# Altium schematic sheet Robonaut2.SchDoc
size A4
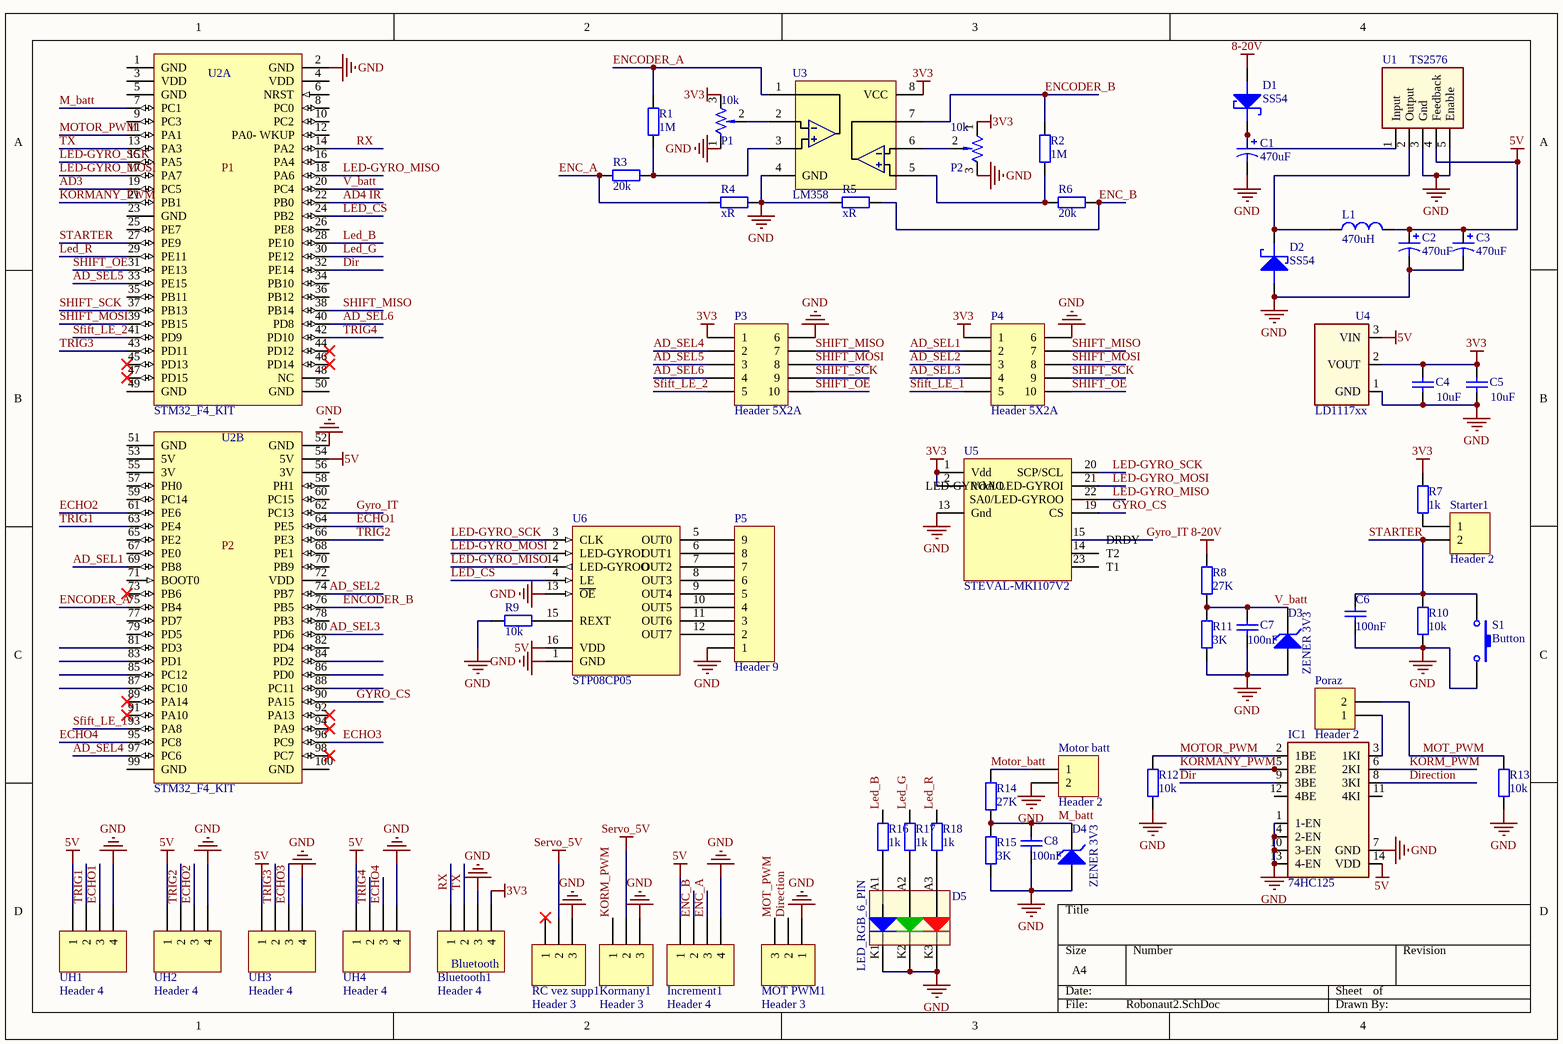
[diagram p0: Robonaut2.SchDoc]

## Parts
Bluetooth1  Header 4  [HDR1X4]
C1  470uF  [cap_10x12]
C2  470uF  [cap_10x12]
C3  470uF  [cap_10x12]
C4  10uF  [FP_0603_CAP_080]
C5  10uF  [FP_0603_CAP_080]
C6  100nF  [FP_0805_CAP_085]
C7  100nF  [FP_0805_CAP_085]
C8  100nF  [FP_0805_CAP_085]
D1  SS54  [FP_SMA DO214AB]
D2  SS54  [FP_SMA DO214AB]
D3  ZENER 3V3  [sod-80]
D4  ZENER 3V3  [sod-80]
D5  LED_RGB_6_PIN  [LED_PLCC-6]
IC1  74HC125  [Gate_SOIC14]
Increment1  Header 4  [HDR1X4]
Kormany1  Header 3  [HDR1X3]
L1  470uH  [SRR1206_T]
MOT_PWM1  Header 3  [HDR1X3]
Motor_batt  Header 2  [HDR1X2]
P1  10k  [Res Trimmer TH]
P2  10k  [Res Trimmer TH]
P3  Header 5X2A  [HDR2X5_CEN]
P4  Header 5X2A  [HDR2X5_CEN]
P5  Header 9  [HDR1X9]
Poraz  Header 2  [HDR1X2]
R1  1M  [FP_0805_RES]
R2  1M  [FP_0805_RES]
R3  20k  [FP_0805_RES]
R4  xR  [FP_0805_RES]
R5  xR  [FP_0805_RES]
R6  20k  [FP_0805_RES]
R7  1k  [FP_0805_RES]
R8  27K  [FP_0805_RES]
R9  10k  [FP_0805_RES]
R10  10k  [FP_0805_RES]
R11  3K  [FP_0805_RES]
R12  10k  [FP_0805_RES]
R13  10k  [FP_0805_RES]
R14  27K  [FP_0805_RES]
R15  3K  [FP_0805_RES]
R16  1k  [FP_0805_RES]
R17  1k  [FP_0805_RES]
R18  1k  [FP_0805_RES]
RC_vez_supp1  Header 3  [HDR1X3]
S1  Button  [BUTTON_6X6 _SMD]
Starter1  Header 2  [HDR1X2]
U1  TS2576  [SUPPLY_TO-263 5]
U2  STM32_F4_KIT  [FP_STM32F4DISC]  (parts A,B of 2)
U3  LM358  [FP_SO8_MS012AA]
U4  LD1117xx  [SUPPLY_SOT223]
U5  STEVAL-MKI107V2  [STEVAL-MKI107V2 DIL24 Adapter]
U6  STP08CP05  [TSSOP16]
UH1  Header 4  [HDR1X4]
UH2  Header 4  [HDR1X4]
UH3  Header 4  [HDR1X4]
UH4  Header 4  [HDR1X4]

## Nets
3V3: Bluetooth1.4 C4.2 C5.2 P1.3 P2.1 P3.1 P4.1 R7.2 U3.8(VCC) U4.2(VOUT) U5.1(Vdd) U5.2(VddIO)
5V: C2.P C3.P IC1.14(VDD) Increment1.1 L1.2 U1.4(Feedback) U2.54(5V) U4.3(VIN) U6.16(VDD) UH1.1 UH2.1 UH3.1 UH4.1
8-20V: D1.A R8.1
GND: Bluetooth1.3 C1.N C2.N C3.N C4.1 C5.1 C6.1 C7.1 C8.1 D2.A D3.A D4.A D5.K1(R) D5.K2(G) D5.K3(B) IC1.1(1-EN) IC1.4(2-EN) IC1.7(GND) IC1.10(3-EN) IC1.13(4-EN) Increment1.4 Kormany1.3 MOT_PWM1.1 Motor_batt.2 P1.1 P2.3 P3.6 P4.6 P5.1 R4.2 R5.1 R9.2 R10.1 R11.2 R12.1 R13.2 R15.2 RC_vez_supp1.3 S1.2 U1.3(Gnd) U1.5(Enable) U2.2(GND) U2.52(GND) U3.4(GND) U4.1(GND) U5.13(Gnd) U6.1(GND) U6.13(~{OE}) UH1.4 UH2.4 UH3.4 UH4.4
Servo_5V: Kormany1.2 RC_vez_supp1.2
AD3: U2.19(PC5)
AD4 IR: U2.22(PB0)
AD_SEL1: P4.2 U2.69(PB8)
AD_SEL2: P4.3 U2.74(PB7)
AD_SEL3: P4.4 U2.80(PD6)
AD_SEL4: P3.2 U2.97(PC6)
AD_SEL5: P3.3 U2.33(PE15)
AD_SEL6: P3.4 U2.40(PD8)
Dir: IC1.9(3BE) U2.32(PE14)
Direction: IC1.8(3KI) MOT_PWM1.2
ECHO1: U2.64(PE5) UH1.3
ECHO2: U2.61(PE6) UH2.3
ECHO3: U2.96(PC9) UH3.3
ECHO4: U2.95(PC8) UH4.3
ENC_A: Increment1.3 R3.1 R4.1
ENC_B: Increment1.2 R5.2 R6.2
ENCODER_A: R1.2 U2.75(PB4) U3.1
ENCODER_B: R2.2 U2.76(PB5) U3.7
GYRO_CS: U2.90(PA15) U5.19(CS)
Gyro_IT: U2.62(PC13) U5.15(DRDY)
KORM_PWM: IC1.6(2KI) Kormany1.1
KORMANY_PWM: IC1.5(2BE) U2.21(PB1)
LED-GYRO_MISO: U2.18(PA6) U5.22(SA0/LED-GYROO) U6.14(LED-GYROO)
LED-GYRO_MOSI: U2.17(PA7) U5.21(LED-GYROA/LED-GYROI) U6.2(LED-GYROI)
LED-GYRO_SCK: U2.15(PA5) U5.20(SCP/SCL) U6.3(CLK)
Led_B: R16.2 U2.28(PE10)
LED_CS: U2.24(PB2) U6.4(LE)
Led_G: R17.2 U2.30(PE12)
Led_R: R18.2 U2.29(PE11)
M_batt: C8.2 D4.K R14.2 R15.1 U2.7(PC1)
MOT_PWM: MOT_PWM1.3 Poraz.2 R13.1
Motor_batt: Motor_batt.1 R14.1
MOTOR_PWM: IC1.2(1BE) R12.2 U2.11(PA1)
RX: Bluetooth1.1 U2.14(PA2)
Sfift_LE_1: P4.5 U2.93(PA8)
Sfift_LE_2: P3.5 U2.41(PD9)
SHIFT_MISO: P3.7 P4.7 U2.38(PB14)
SHIFT_MOSI: P3.8 P4.8 U2.39(PB15)
SHIFT_OE: P3.10 P4.10 U2.31(PE13)
SHIFT_SCK: P3.9 P4.9 U2.37(PB13)
STARTER: C6.2 R10.2 S1.1 Starter1.2 U2.27(PE9)
TRIG1: U2.63(PE4) UH1.2
TRIG2: U2.66(PE3) UH2.2
TRIG3: U2.43(PD11) UH3.2
TRIG4: U2.42(PD10) UH4.2
TX: Bluetooth1.2 U2.13(PA3)
V_batt: C7.2 D3.K R8.2 R11.1 U2.20(PC4)
NetC1_P: C1.P D1.K U1.1(Input)
NetD2_K: D2.K L1.1 U1.2(Output)
NetD5_A1: D5.A1(A) R16.1
NetD5_A2: D5.A2(A) R17.1
NetD5_A3: D5.A3(A) R18.1
NetIC1_3: IC1.3(1KI) Poraz.1
NetP1_2: P1.2(t) U3.2
NetP2_2: P2.2(t) U3.6
NetP5_2: P5.2 U6.12(OUT7)
NetP5_3: P5.3 U6.11(OUT6)
NetP5_4: P5.4 U6.10(OUT5)
NetP5_5: P5.5 U6.9(OUT4)
NetP5_6: P5.6 U6.8(OUT3)
NetP5_7: P5.7 U6.7(OUT2)
NetP5_8: P5.8 U6.6(OUT1)
NetP5_9: P5.9 U6.5(OUT0)
NetR1_1: R1.1 R3.2 U3.3
NetR2_1: R2.1 R6.1 U3.5
NetR7_1: R7.1 Starter1.1
NetR9_1: R9.1 U6.15(REXT)

Not connected (* = marked no-connect by the designer): IC1 11(4KI) 12(4BE); RC_vez_supp1 1*; U2 1(GND) 3(VDD) 4(VDD) 5(GND) 6(NRST) 8(PC0) 9(PC3) 10(PC2) 12(PA0-_WKUP) 16(PA4) 23(GND) 25(PE7) 26(PE8) 34(PB10) 35(PB11) 36(PB12) 44(PD12)* 45(PD13)* 46(PD14)* 47(PD15)* 48(NC) 49(GND) 50(GND) 51(GND) 53(5V) 55(3V) 56(3V) 57(PH0) 58(PH1) 59(PC14) 60(PC15) 65(PE2) 67(PE0) 68(PE1) 70(PB9) 71(BOOT0) 72(VDD) 73(PB6)* 77(PD7) 78(PB3) 79(PD5) 81(PD3) 82(PD4) 83(PD1) 84(PD2) 85(PC12) 86(PD0) 87(PC10) 88(PC11) 89(PA14)* 91(PA10)* 92(PA13)* 94(PA9)* 98(PC7)* 99(GND) 100(GND); U5 14(T2) 23(T1)

## Notes on the sheet
- Bluetooth
- (in symbol STM32F4DISCOVERY, part A) P1
- (in symbol STM32F4DISCOVERY, part B) P2

## Library data of the parts
Bluetooth1 Increment1 UH1-UH4 = Header 4: Header, 4-Pin; LatestRevisionDate: 17-Jul-2002; LatestRevisionNote: Re-released for DXP Platform.; Publisher: Altium Limited
C1-C3 = CAP_ELECT: Polarized Capacitor; Value: 470uF
C4 C5 = Cap: Capacitor; Value: 100nF; Tûrés: 20% X7R; Published: 8-Jun-2000; LatestRevisionDate: 17-Jul-2002; LatestRevisionNote: Re-released for DXP Platform.; PackageReference: RAD-0.3; Publisher: Altium Limited; Order info: 82-07-81
C6-C8 = CAP: Capacitor; Value: 100nF
D1 D2 = SCHOTTKY: NXP - PMEG3020EJ,115 - SCHOTTKY RECT 30V 2A SOD323F; Supplier: Farnell 1757772
D3 D4 = ZENER: Zener Diode; U_Z: 24
Kormany1 MOT_PWM1 RC_vez_supp1 = Header 3: Header, 3-Pin; LatestRevisionDate: 17-Jul-2002; LatestRevisionNote: Re-released for DXP Platform.; Publisher: Altium Limited
L1 = L: Order info: RET: 77-01-48  // lomex: 93-03-38
Motor_batt Poraz Starter1 = Header 2: Header, 2-Pin; LatestRevisionDate: 17-Jul-2002; LatestRevisionNote: Re-released for DXP Platform.; Publisher: Altium Limited
P1 P2 = POTI: SET: 0.5; PSpiceTemplate: RT^@REFDES %1 %t {(@VALUE*(1-@SET))+.001}\nRB^@REFDES %t %2 {(@VALUE*@SET)+.001}
P3 P4 = Header 5X2A: Header, 5-Pin, Dual row; LatestRevisionDate: 17-Jul-2002; LatestRevisionNote: Re-released for DXP Platform.; Publisher: Altium Limited
P5 = Header 9: Header, 9-Pin; LatestRevisionDate: 17-Jul-2002; LatestRevisionNote: Re-released for DXP Platform.; Publisher: Altium Limited
R1-R18 = RES: Resistor
  R1 R2: Value: 1M
  R3 R6: Value: 20k
  R4 R5: Value: xR
  R7 R16-R18: Value: 1k
  R8 R14: Value: 27K
  R9 R10 R12 R13: Value: 10k
  R11 R15: Value: 3K
S1 = SW-PB: Switch; Published: 24-Mar-1999; LatestRevisionDate: 17-Jul-2002; LatestRevisionNote: Re-released for DXP Platform.; PackageReference: SPST-2; Publisher: Altium Limited; Order info: http://www.tme.eu/hu/details/tactm-67n-f/tact-pcb-mikrokapcsolok/ninigi/#
U1 = TS2576: 5V 3A step down
U2 = STM32F4DISCOVERY: STM32 F4 Discovery Evaluation Kit
U3 = LM358: Low power dual operational amplifiers
U4 = LD1117xx: LD1117xx 3,3V lin reg; Order info: http://hu.mouser.com/ProductDetail/NXP/NX1117C33Z115/?qs=%2fha2pyFadui8%252bOpsKr9N%2fhvfdxjCMx%252bF0NTwqG%252bWOJY%3d
U5 = STEVAL-MKI107V2: Three-axis digital output gyroscope; Manufacturer: STMicroelectronic; Voltage Supply: 2.4 V - 3.6 V; Supply Current: 6.1 mA; Manufacturer webpage: http://www.st.com/internet/evalboard/product/253478.jsp; Datasheet: .\Datasheet\L3GD20.pdf; .\Datasheet\STEVAL-MKI107V2.pdf
U6 = STP08CP05: 8 channel constant current LED driver; Manufacturer: STMicroelectronic; Output current / pin: 5-100mA; Supply Voltage: 3 V - 5 V; Max Supply Current: 800 mA; Manufacturer webpage: http://www.st.com/internet/analog/product/172077.jsp; Datasheet: .\Datasheet\STP08CP05.pdf
D5 = LED_RGB_6_PIN: Order info: http://it.mouser.com/ProductDetail/OSRAM-Opto-Semiconductors/LRTBGFTM-ST7-1+VV9-29+Q5R/?qs=sGAEpiMZZMvyj6n1w4pZD%2ffl%252b8TIkxpNpOowvvOydA0%3d